# Altium project fuzz.PrjPcb
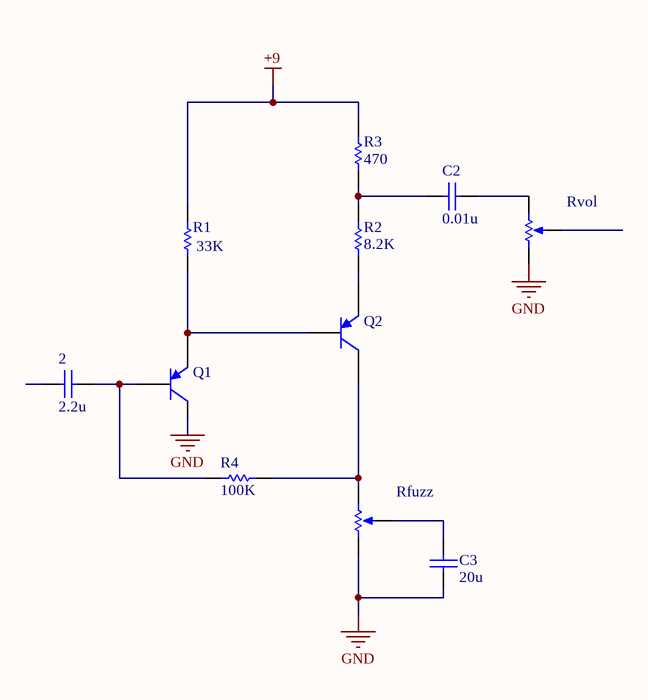
[diagram p0: fuzz.SchDoc]
1 sheet, 11 parts. Net scope: global (net labels, ports and power ports of the same name join across sheets).

## Sheet fuzz.SchDoc
size A4; SheetNumber: 1; SheetTotal: 1

### Parts
2  value 2.2u  (hidden comment: Capacitor)
C2  value 0.01u  (hidden comment: Capacitor)
C3  value 20u  (hidden comment: Capacitor)
Q1  Bipolar PNP 3 Pins Transistor Gummel-Poon Model  (value not drawn)
Q2  Bipolar PNP 3 Pins Transistor Gummel-Poon Model  (value not drawn)
R1  value 33K  (hidden comment: Resistor)
R2  value 8.2K  (hidden comment: Resistor)
R3  value 470  (hidden comment: Resistor)
R4  value 100K  (hidden comment: Resistor)
Rfuzz  Potentiometer  (value not drawn)
Rvol  Potentiometer  (value not drawn)

### Nets
+9: R1.1 R3.2
GND: C3.1 Q1.1(C) Rfuzz.1(TOP) Rvol.1(TOP)
Net2_2: 2.2 Q1.2(B) R4.2
NetC2_1: C2.1 R2.2 R3.1
NetC2_2: C2.2 Rvol.2(BOT)
NetC3_2: C3.2 Rfuzz.3(TAP)
NetQ1_3: Q1.3(E) Q2.2(B) R1.2
NetQ2_1: Q2.1(C) R4.1 Rfuzz.2(BOT)
NetQ2_3: Q2.3(E) R2.1

Not connected (* = marked no-connect by the designer): 2 1; Rvol 3(TAP)

### Library data of the parts
2 C2 C3 = Capacitor: SimulationGenericComponent: True
Q1 Q2 = BJT PNP GP: BF: 100; AF: 0; BR: 1; EG: 1.11; FC: 0.5; IS: 1e-16; MJC: 0.33; NC: 2; NE: 1.5; TNOM: 27; VBC_MAX: 1e99; VJC: 0.75; XTI: 3; SimulationGenericComponent: True; CJC: 0; CJE: 0; CJS: 0; CTC: 0; CTE: 0; CTS: 0; IKF: 0; IKR: 0; IRB: 0; ISC: 0; ISE: 0; ISS: 0; ITF: 0; KF: 0; MJE: 0.33; MJS: 0; NF: 1; NKF: 0.5; NR: 1; NS: 1; PTF: 0; RB: 0; RBM: 0; RC: 0; RE: 0; SUBS: 1; TBF1: 0; TBF2: 0; TBR1: 0; TBR2: 0; TF: 0; TIKF1: 0; TIKF2: 0; TIKR1: 0; TIKR2: 0; TIRB1: 0; TIRB2: 0; TIS1: 0; TIS2: 0; TISC1: 0; TISC2: 0; TISE1: 0; TISE2: 0; TITF1: 0; TITF2: 0; TLEV: 0; TLEVC: 0; TMJC1: 0; TMJC2: 0; TMJE1: 0; TMJE2: 0; TMJS1: 0; TMJS2: 0; TNC1: 0; TNC2: 0; TNE1: 0; TNE2: 0; TNF1: 0; TNF2: 0; TNR1: 0; TNR2: 0; TNS1: 0; TNS2: 0; TR: 0; TRB1: 0; TRB2: 0; TRC1: 0; TRC2: 0; TRE1: 0; TRE2: 0; TRM1: 0; TRM2: 0; TTF1: 0; TTF2: 0; TTR1: 0; TTR2: 0; TVAF1: 0; TVAF2: 0; TVAR1: 0; TVAR2: 0; TVJC: 0; TVJE: 0; TVJS: 0; VAF: 0; VAR: 0; VBE_MAX: 1e99; VCE_MAX: 1e99; VJE: 0.75; VJS: 0.75; VTF: 0; XCJC: 1; XTB: 0; XTF: 0
R1-R4 = Resistor: TC1: 0; SimulationGenericComponent: True; TC2: 0
Rfuzz = Potentiometer: value: 1k; position: 0.5; SimulationGenericComponent: True
Rvol = Potentiometer: value: 500K; position: 0.5; SimulationGenericComponent: True